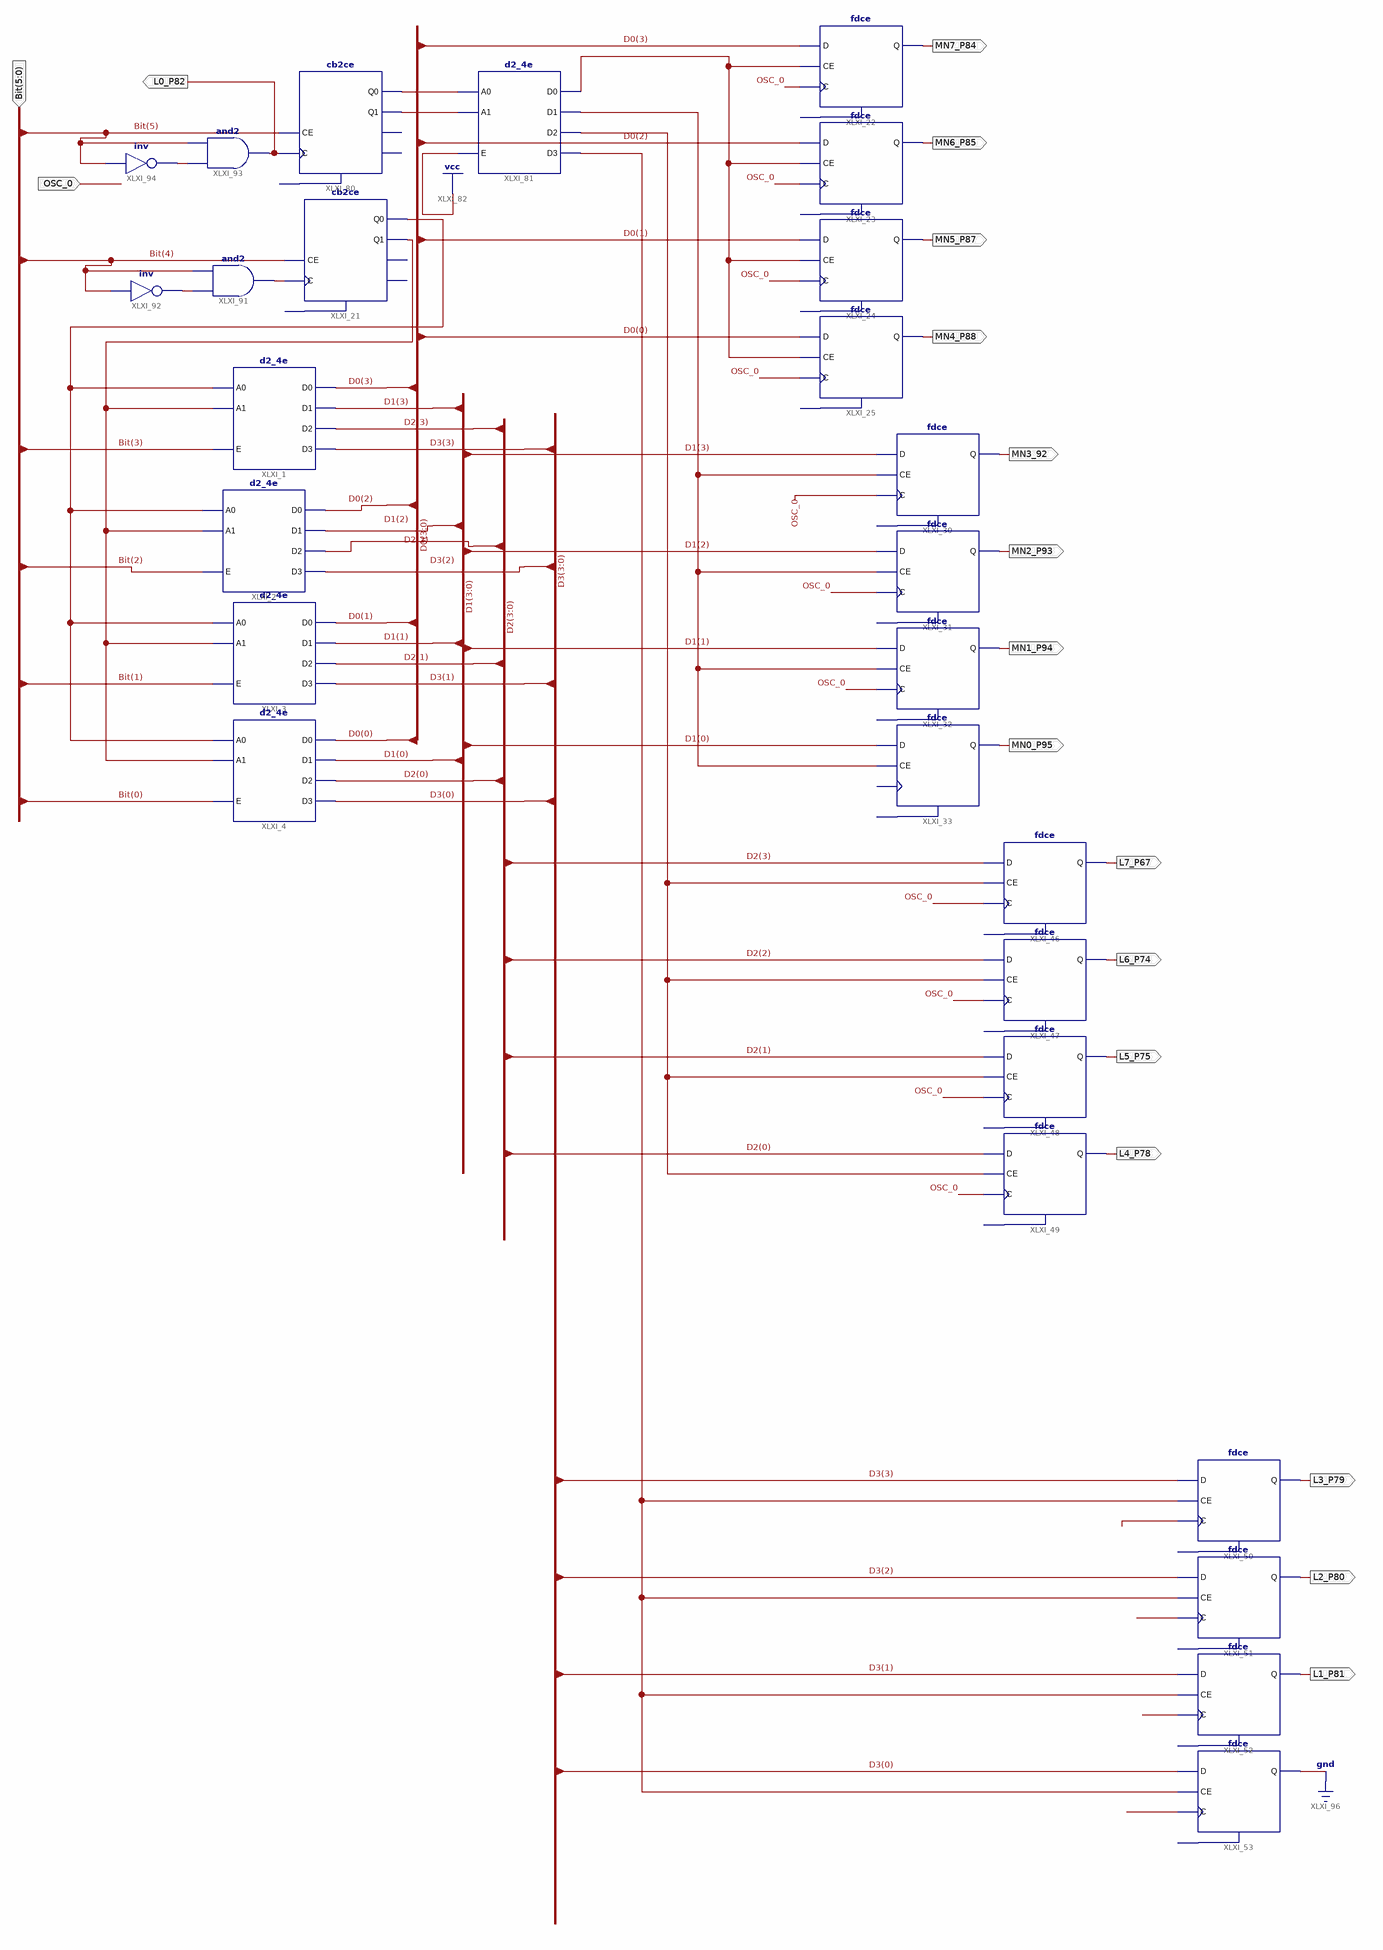
[diagram p0: schematic sheet 1]
// Xilinx ISE schematic Demux5_20.sch (spartan6) as structural Verilog: 27 symbols, 18 ports
module Demux5_20 (
  input  [5:0] Bit,
  input  OSC_0,
  output MN7_P84,
  output MN6_P85,
  output MN5_P87,
  output MN4_P88,
  output MN3_92,
  output MN2_P93,
  output MN1_P94,
  output MN0_P95,
  output L7_P67,
  output L6_P74,
  output L5_P75,
  output L4_P78,
  output L3_P79,
  output L2_P80,
  output L1_P81,
  output L0_P82
);

  wire XLXN_86, XLXN_87, XLXN_92, XLXN_93, XLXN_134, XLXN_135, XLXN_136, XLXN_137, XLXN_141, XLXN_143,
       XLXN_149, XLXN_150, XLXN_166, XLXN_167, XLXN_169;
  wire [3:0] D0, D1, D2, D3;

  d2_4e XLXI_1 (.A0(XLXN_86), .A1(XLXN_87), .E(Bit[3]), .D0(D0[3]), .D1(D1[3]), .D2(D2[3]), .D3(D3[3]));
  d2_4e XLXI_2 (.A0(XLXN_86), .A1(XLXN_87), .E(Bit[2]), .D0(D0[2]), .D1(D1[2]), .D2(D2[2]), .D3(D3[2]));
  d2_4e XLXI_3 (.A0(XLXN_86), .A1(XLXN_87), .E(Bit[1]), .D0(D0[1]), .D1(D1[1]), .D2(D2[1]), .D3(D3[1]));
  d2_4e XLXI_4 (.A0(XLXN_86), .A1(XLXN_87), .E(Bit[0]), .D0(D0[0]), .D1(D1[0]), .D2(D2[0]), .D3(D3[0]));
  fdce XLXI_22 (.C(OSC_0), .CE(XLXN_149), .D(D0[3]), .Q(MN7_P84));  // open: CLR
  fdce XLXI_23 (.C(OSC_0), .CE(XLXN_149), .D(D0[2]), .Q(MN6_P85));  // open: CLR
  fdce XLXI_24 (.C(OSC_0), .CE(XLXN_149), .D(D0[1]), .Q(MN5_P87));  // open: CLR
  fdce XLXI_25 (.C(OSC_0), .CE(XLXN_149), .D(D0[0]), .Q(MN4_P88));  // open: CLR
  fdce XLXI_30 (.C(OSC_0), .CE(XLXN_143), .D(D1[3]), .Q(MN3_92));  // open: CLR
  fdce XLXI_31 (.C(OSC_0), .CE(XLXN_143), .D(D1[2]), .Q(MN2_P93));  // open: CLR
  fdce XLXI_32 (.C(OSC_0), .CE(XLXN_143), .D(D1[1]), .Q(MN1_P94));  // open: CLR
  fdce XLXI_33 (.CE(XLXN_143), .D(D1[0]), .Q(MN0_P95));  // open: C, CLR
  fdce XLXI_46 (.C(OSC_0), .CE(XLXN_150), .D(D2[3]), .Q(L7_P67));  // open: CLR
  fdce XLXI_47 (.C(OSC_0), .CE(XLXN_150), .D(D2[2]), .Q(L6_P74));  // open: CLR
  fdce XLXI_48 (.C(OSC_0), .CE(XLXN_150), .D(D2[1]), .Q(L5_P75));  // open: CLR
  fdce XLXI_49 (.C(OSC_0), .CE(XLXN_150), .D(D2[0]), .Q(L4_P78));  // open: CLR
  fdce XLXI_50 (.C(XLXN_134), .CE(XLXN_141), .D(D3[3]), .Q(L3_P79));  // open: CLR
  fdce XLXI_51 (.C(XLXN_135), .CE(XLXN_141), .D(D3[2]), .Q(L2_P80));  // open: CLR
  fdce XLXI_52 (.C(XLXN_136), .CE(XLXN_141), .D(D3[1]), .Q(L1_P81));  // open: CLR
  fdce XLXI_53 (.C(XLXN_137), .CE(XLXN_141), .D(D3[0]), .Q(1'b0));  // open: CLR
  cb2ce XLXI_21 (.C(XLXN_166), .CE(Bit[4]), .Q0(XLXN_86), .Q1(XLXN_87));  // open: CLR, CEO, TC
  cb2ce XLXI_80 (.C(L0_P82), .CE(Bit[5]), .Q0(XLXN_93), .Q1(XLXN_92));  // open: CLR, CEO, TC
  d2_4e XLXI_81 (.A0(XLXN_93), .A1(XLXN_92), .E(1'b1), .D0(XLXN_149), .D1(XLXN_143), .D2(XLXN_150), .D3(XLXN_141));
  and XLXI_91 (XLXN_166, XLXN_167, Bit[4]);
  not XLXI_92 (XLXN_167, Bit[4]);
  and XLXI_93 (L0_P82, XLXN_169, Bit[5]);
  not XLXI_94 (XLXN_169, Bit[5]);
endmodule
